# Altium schematic sheet Sheet1.SchDoc
size A4; SheetNumber: 1; SheetTotal: 1
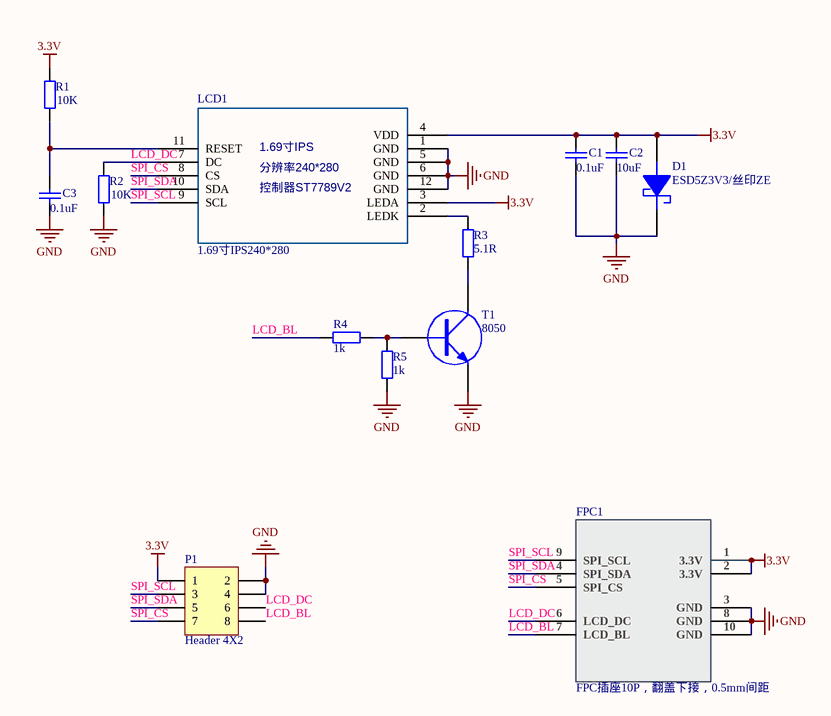
[diagram p0: Sheet1.SchDoc]

## Parts
C1  0.1uF  [0402-CAP]
C2  10uF  [0402-CAP]
C3  0.1uF  [0402-CAP]
D1  ESD5Z3V3/丝印ZE  [SOD523]
FPC1  FPC插座10P，翻盖下接，0.5mm间距  [FPC10P-0.5MM]
LCD1  1.69寸IPS240*280  [1.69寸IPS240*280]
P1  Header 4X2  [HDR2X4]
R1  10K  [0402-RES]
R2  10K  [0402-RES]
R3  5.1R  [0402-res]
R4  1k  [0402-res]
R5  1k  [0402-res]
T1  8050  [SO-G3/C2.25]

## Nets
3.3V: C1.2 C2.2 D1.1(+) FPC1.1(3.3V) FPC1.2(3.3V) LCD1.3(LEDA) LCD1.4(VDD) P1.1 R1.2
GND: C1.1 C2.1 C3.1 D1.2(-) FPC1.3(GND) FPC1.8(GND) FPC1.10(GND) LCD1.1(GND) LCD1.5(GND) LCD1.6(GND) LCD1.12(GND) P1.2 P1.4 R2.1 R5.1 T1.1(E)
LCD_BL: FPC1.7(LCD_BL) P1.8 R4.1
LCD_DC: FPC1.6(LCD_DC) LCD1.7(DC) P1.6 R2.2
SPI_CS: FPC1.5(SPI_CS) LCD1.8(CS) P1.7
SPI_SCL: FPC1.9(SPI_SCL) LCD1.9(SCL) P1.3
SPI_SDA: FPC1.4(SPI_SDA) LCD1.10(SDA) P1.5
NetC3_2: C3.2 LCD1.11(RESET) R1.1
NetLCD1_2: LCD1.2(LEDK) R3.2
NetR3_1: R3.1 T1.3(C)
NetR4_2: R4.2 R5.2 T1.2(B)

## Notes on the sheet
- (in symbol 1.69寸IPS240*280) 1.69寸IPS; 分辨率240*280; 控制器ST7789V2

## Library data of the parts
C1-C3 = Cap1
D1 = TVS
FPC1 = LCD-SPI
P1 = Header 4X2: Header, 4-Pin, Dual row
R1 R2 = Res
R3-R5 = Res1